# Altium project TIMER_COUNTER_MAIN.PrjPcb
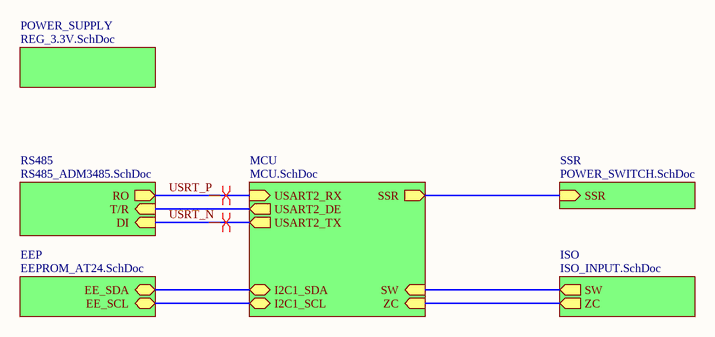
[diagram p0: MAIN.SchDoc]
7 sheets, 64 parts. Net scope: hierarchical (ports join the sheet entries above them; power ports are global).
Board file: TIMER_COUNTER_MAIN.PcbDoc
Sheets:
  MAIN.SchDoc
    EEP = EEPROM_AT24.SchDoc
    ISO = ISO_INPUT.SchDoc
    MCU = MCU.SchDoc
    SSR = POWER_SWITCH.SchDoc
    POWER_SUPPLY = REG_3.3V.SchDoc
    RS485 = RS485_ADM3485.SchDoc

## Sheet MAIN.SchDoc
size 381 x 241 mm; SheetNumber: 1; SheetTotal: 7

### Sub-sheets
EEP = EEPROM_AT24.SchDoc: EE_SCL (bidir), EE_SDA (bidir)
ISO = ISO_INPUT.SchDoc: SW (out), ZC (out)
MCU = MCU.SchDoc: SSR (out), ZC (in), SW (in), USART2_DE (out), USART2_RX (in), USART2_TX (out), I2C1_SCL (bidir), I2C1_SDA (bidir)
POWER_SUPPLY = REG_3.3V.SchDoc: no entries
RS485 = RS485_ADM3485.SchDoc: RO (out), T/R (in), DI (in)
SSR = POWER_SWITCH.SchDoc: SSR (in)

### Nets
USRT_N: sheet MCU/USART2_TX, sheet RS485/DI
USRT_P: sheet MCU/USART2_RX, sheet RS485/RO
NetC8_2: sheet EEP/EE_SCL, sheet MCU/I2C1_SCL
NetC9_2: sheet EEP/EE_SDA, sheet MCU/I2C1_SDA
NetR3_1: sheet ISO/SW, sheet MCU/SW
NetR5_1: sheet ISO/ZC, sheet MCU/ZC
NetR12_2: sheet MCU/SSR, sheet SSR/SSR
NetR20_1: sheet MCU/USART2_DE, sheet RS485/T/R

### Layout directives
differential pair: USRT_N, USRT_P

## Sheet EEPROM_AT24.SchDoc
size A; SheetNumber: 6; SheetTotal: 7
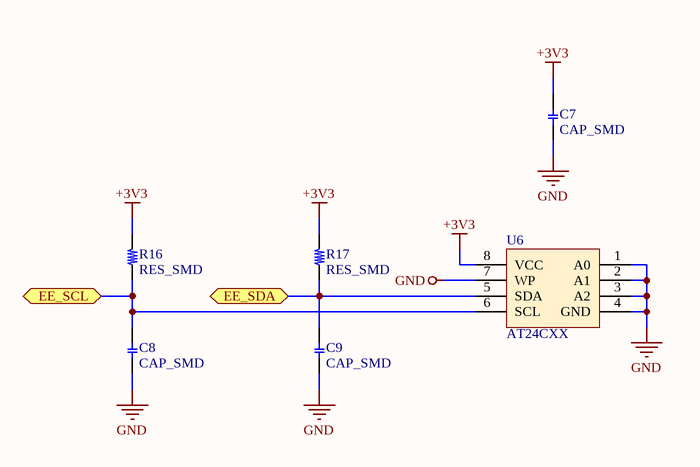
[diagram p1: EEPROM_AT24.SchDoc]

### Parts
C7  CAP_SMD  [C 0603]
C8  CAP_SMD  [C 0603]
C9  CAP_SMD  [C 0603]
R16  RES_SMD  [R 0603]
R17  RES_SMD  [R 0603]
U6  AT24CXX  [SOIC-8]

### Ports
EE_SCL (bidir), EE_SDA (bidir)

### Nets
+3V3: C7.2 R16.2 R17.2 U6.8(VCC)
GND: C7.1 C8.1 C9.1 U6.1(A0) U6.2(A1) U6.3(A2) U6.4(GND) U6.7(WP)
NetC8_2: C8.2 R16.1 U6.6(SCL) ; port EE_SCL
NetC9_2: C9.2 R17.1 U6.5(SDA) ; port EE_SDA

## Sheet ISO_INPUT.SchDoc
size 381 x 241 mm; SheetNumber: 2; SheetTotal: 7
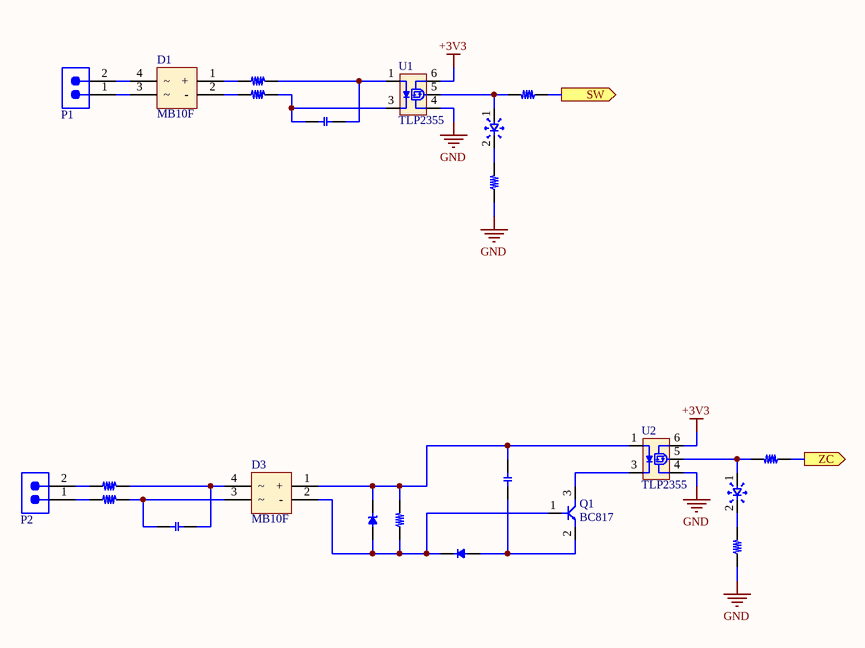
[diagram p2: ISO_INPUT.SchDoc]

### Parts
C1  CAP_SMD  [C 1206]  (value not drawn)
C2  CAP_SMD  [C 1206]  (value not drawn)
C3  CAP_SMD  [C 1206]  (value not drawn)
D1  MB10F  [MBF]
D2  LED_SMD  [D 0603]  (value not drawn)
D3  MB10F  [MBF]
D4  LED_SMD  [D 0603]  (value not drawn)
D5  DIOD_SMD_ZENER  [DIOD_SMA]  (value not drawn)
D6  DIOD_SMD  [DIOD_SMA]  (value not drawn)
P1  691321300002  [691321300002]  (value not drawn)
P2  691321300002  [691321300002]  (value not drawn)
Q1  BC817  [SOT-23_3_Q]
R1  RES_SMD  [R 1206]  (value not drawn)
R2  RES_SMD  [R 1206]  (value not drawn)
R3  RES_SMD  [R 0603]  (value not drawn)
R4  RES_SMD  [R 0603]  (value not drawn)
R5  RES_SMD  [R 0603]  (value not drawn)
R6  RES_SMD  [R 1206]  (value not drawn)
R7  RES_SMD  [R 1206]  (value not drawn)
R8  RES_SMD  [R 1206]  (value not drawn)
R9  RES_SMD  [R 0603]  (value not drawn)
U1  TLP2355  [SOIC-6-5]
U2  TLP2355  [SOIC-6-5]

### Ports
SW (out), ZC (out)

### Nets
+3V3: U1.6(VCC) U2.6(VCC)
GND: R4.1 R9.1 U1.4(GND) U2.4(GND)
NetC1_1: C1.1 R2.2 U1.3(K)
NetC1_2: C1.2 R1.2 U1.1(A)
NetC2_1: C2.1 D3.1(+) D5.2 R8.2 U2.1(A)
NetC2_2: C2.2 D6.1 Q1.2(E)
NetC3_1: C3.1 D3.3 R7.2
NetC3_2: C3.2 D3.4 R6.2
NetD1_1: D1.1(+) R1.1
NetD1_2: D1.2(-) R2.1
NetD1_3: D1.3 P1.1
NetD1_4: D1.4 P1.2
NetD2_1: D2.1 R3.2 U1.5(OUT)
NetD2_2: D2.2 R4.2
NetD3_2: D3.2(-) D5.1 D6.2 Q1.1(B) R8.1
NetD4_1: D4.1 R5.2 U2.5(OUT)
NetD4_2: D4.2 R9.2
NetP2_1: P2.1 R7.1
NetP2_2: P2.2 R6.1
NetQ1_3: Q1.3(C) U2.3(K)
NetR3_1: R3.1 ; port SW
NetR5_1: R5.1 ; port ZC

### Library data of the parts
P1 P2 = 691321300002: WR-TBL Series 321 Vertical PCB Header, Through Hole, pitch 3.81mm, 2p; Manufacturer: Wurth Elektronik; Pin Number: 2; Rated Current: 10A; Working Voltage: 300V; Modularity: No; ComponentLink1Description: Manufacturer Link; ComponentLink1URL: https://www.we-online.com/redexpert/article/691321300002?ad; ComponentLink2Description: Datasheet; ComponentLink2URL: https://www.we-online.com/redexpert/spec/691321300002?ad; Category: Terminal Blocks; Match Code: WR-TBL; Manufacturer Part Number: 691321300002; Mount: Through Hole; Operating Temperature Max: 105°C; Operating Temperature Min: -40°C; Packaging: Box; Pitch: 3.81mm; Orientation: Vertical; Application: Pluggable; PCB/Cable/Panel: PCB

## Sheet MCU.SchDoc
size 381 x 241 mm; SheetNumber: 5; SheetTotal: 7
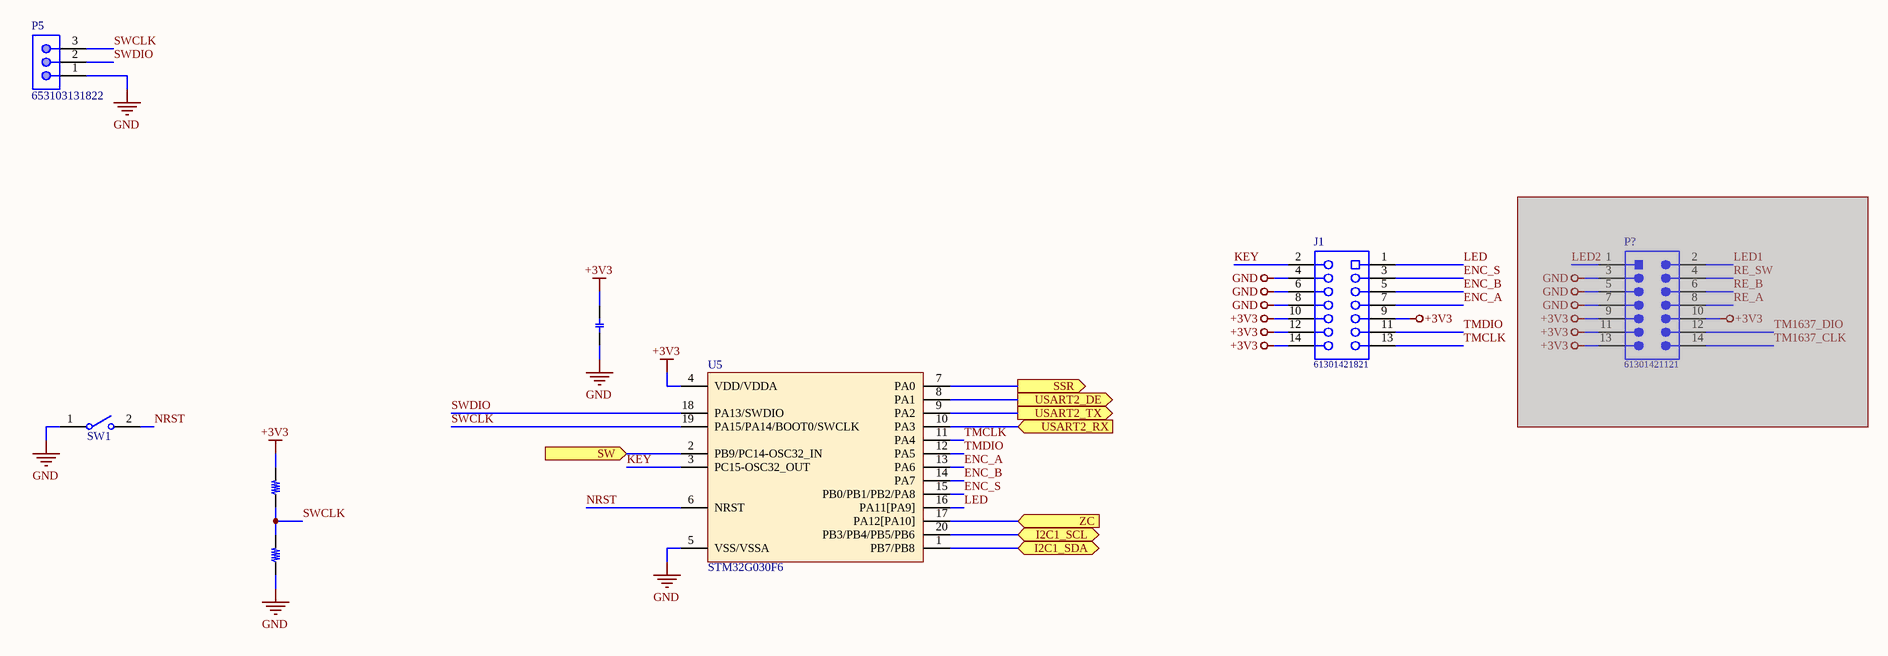
[diagram p3: MCU.SchDoc]

### Parts
C6  CAP_SMD  [C 0603]  (value not drawn)
J1  61301421821  [61301421821]
P5  653103131822  [653103131822]
P?  61301421121  [61301421121]  (masked out: inside a compile mask, not in the netlist)
R14  RES_SMD  [R 0603]  (value not drawn)
R15  RES_SMD  [R 0603]  (value not drawn)
SW1  430133050816  [WS-TASV_L6W6H5_4301330508x6]  (value not drawn)
U5  STM32G030F6  [TSSOP-20]

### Ports
I2C1_SCL (bidir), I2C1_SDA (bidir), SSR (out), SW (in), USART2_DE (out), USART2_RX (in), USART2_TX (out), ZC (in)

### Nets
+3V3: C6.2 J1.9 J1.10 J1.12 J1.14 R14.2 U5.4(VDD/VDDA)
GND: C6.1 J1.4 J1.6 J1.8 P5.1 R15.1 SW1.1 U5.5(VSS/VSSA)
ENC_A: J1.7 U5.13(PA6)
ENC_B: J1.5 U5.14(PA7)
ENC_S: J1.3 U5.15(PB0/PB1/PB2/PA8)
KEY: J1.2 U5.3(PC15-OSC32_OUT)
LED: J1.1 U5.16(PA11[PA9])
NRST: SW1.2 U5.6(NRST)
SWCLK: P5.3 R14.1 R15.2 U5.19(PA15/PA14/BOOT0/SWCLK)
SWDIO: P5.2 U5.18(PA13/SWDIO)
TMCLK: J1.13 U5.11(PA4)
TMDIO: J1.11 U5.12(PA5)
USRT_N: U5.9(PA2) ; port USART2_TX
USRT_P: U5.10(PA3) ; port USART2_RX
NetC8_2: U5.20(PB3/PB4/PB5/PB6) ; port I2C1_SCL
NetC9_2: U5.1(PB7/PB8) ; port I2C1_SDA
NetR3_1: U5.2(PB9/PC14-OSC32_IN) ; port SW
NetR5_1: U5.17(PA12[PA10]) ; port ZC
NetR12_2: U5.7(PA0) ; port SSR
NetR20_1: U5.8(PA1) ; port USART2_DE

### Library data of the parts
J1 = 61301421821: WR-PHD Socket Header, THT, pitch 2.54mm, Dual Row, Vertical, 14p; Manufacturer: Wurth Elektronik; Pin Number: 14; Rated Current: 3A; Working Voltage: 250VAC; Withstanding Voltage: 500VAC; Contact Resistance: 20mOhm; ComponentLink1Description: Manufacturer; ComponentLink1URL: http://www.we-online.de; ComponentLink2Description: Datasheet; ComponentLink2URL: https://www.we-online.com/catalog/datasheet/61301421821.pdf; Manufacturer Part Number: 61301421821; Pitch: 2.54mm; Operating Temperature: -40 to +125degC; Mounting Technology: THT; Packaging: Tray; Gender: Socket Header; Row Number: Dual; Orientation: Vertical
P5 = 653103131822: WR-WTB SMT Male Horizontal Shrouded Header, pitch 1.25mm, 3p; Pin Number: 3; Contact Resistance: 20mOhm; Rated Current: 1A; Withstanding Voltage: 250VAC; Working Voltage: 125VAC; ComponentLink1Description: Manufacturer; ComponentLink1URL: http://www.we-online.de; ComponentLink2Description: Datasheet; ComponentLink2URL: https://www.we-online.com/catalog/datasheet/653103131822.pdf; Pitch: 1.25mm; Published Date: January 2020; Publisher: Wurth Elektronik; Mounting Technology: SMT; Packaging: Tape and Reel; Operating Temperature: -40 to +85degC; Part Number: 653103131822; Gender: Male; Type: Horizontal
P? = 61301421121: WR-PHD Pin Header, THT, pitch 2.54mm, Dual Row, Vertical, 14p; Manufacturer: Wurth Elektronik; Pin Number: 14; Rated Current: 3A; Working Voltage: 250VAC; Withstanding Voltage: 500VAC; Contact Resistance: 20mOhm; ComponentLink1Description: Manufacturer; ComponentLink1URL: http://www.we-online.de; ComponentLink2Description: Datasheet; ComponentLink2URL: https://www.we-online.com/catalog/datasheet/61301421121.pdf; Manufacturer Part Number: 61301421121; Pitch: 2.54mm; Operating Temperature: -40 to +105degC; Mounting Technology: THT; Packaging: Bag; Gender: Pin Header; Row Number: Dual; Orientation: Vertical
SW1 = 430133050816: WS-TASV SMT long travel tact switch, L6 x W6 x H5mm, 160g, SPST-NO, 16V, 50mA; Manufacturer: Wurth Elektronik; Washable: No; Manufacturer Part Number: 430133050816; Category: Tact Switches; Match Code: WS-TASV; ComponentLink1Description: Website Link; ComponentLink1URL: https://www.we-online.com/redexpert/article/430133050816?ad; ComponentLink2Description: Datasheet Link; ComponentLink2URL: https://www.we-online.com/redexpert/spec/430133050816?ad; Mount: Surface Mount; Operating Temperature Max: 125°C; Operating Temperature Min: -40°C; Packaging: Tape and Reel; Length: 6mm; Width: 6mm; Height: 5mm; Circuit: SPST-NO; Contact Material: Stainless Steel; Contact Plating: Silver; Operation Force: 160g; Rated Current: 50mA; Rated Voltage (DC): 16V; Terminal Material: Copper Alloy; Terminal Plating: Silver

## Sheet POWER_SWITCH.SchDoc
size A; SheetNumber: 4; SheetTotal: 7
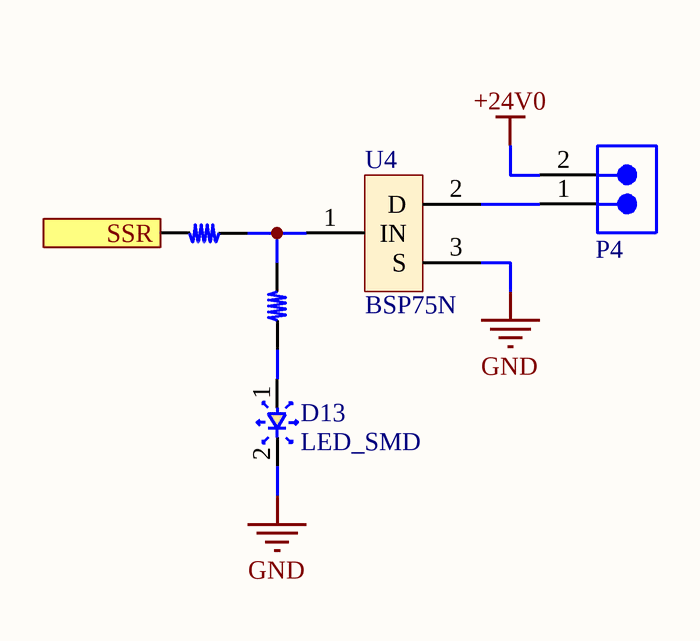
[diagram p4: POWER_SWITCH.SchDoc]

### Parts
D13  LED_SMD  [D 0603]
P4  691321300002  [691321300002]  (value not drawn)
R12  RES_SMD  [R 0603]  (value not drawn)
R13  RES_SMD  [R 0603]  (value not drawn)
U4  BSP75N  [SOT-223 - BSP75N]

### Ports
SSR (in)

### Nets
+24V0: P4.2
GND: D13.2 U4.3(S)
NetD13_1: D13.1 R13.1
NetP4_1: P4.1 U4.2(D)
NetR12_1: R12.1 R13.2 U4.1(IN)
NetR12_2: R12.2 ; port SSR

### Library data of the parts
P4 = 691321300002: as P1 on sheet ISO_INPUT; ComponentLink1Description: Manufacturer Link; ComponentLink1URL: https://www.we-online.com/redexpert/article/691321300002?ad; ComponentLink2Description: Datasheet; ComponentLink2URL: https://www.we-online.com/redexpert/spec/691321300002?ad; Category: Terminal Blocks; Match Code: WR-TBL; Manufacturer Part Number: 691321300002; Mount: Through Hole; Operating Temperature Max: 105°C; Operating Temperature Min: -40°C; Packaging: Box; Pitch: 3.81mm; Orientation: Vertical; Application: Pluggable; PCB/Cable/Panel: PCB

## Sheet REG_3.3V.SchDoc
size A; SheetNumber: 3; SheetTotal: 7
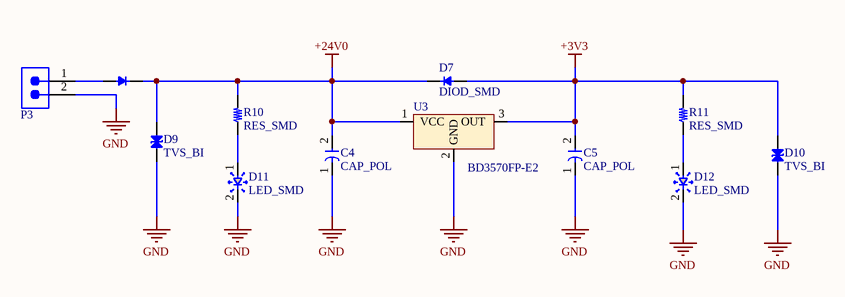
[diagram p5: REG_3.3V.SchDoc]

### Parts
C4  CAP_POL  [CAP_SMC]
C5  CAP_POL  [CAP_SMA]
D7  DIOD_SMD  [DIOD_SMA]
D8  DIOD_SMD  [DIOD_SMA]  (value not drawn)
D9  TVS_BI  [DIOD_SMB]
D10  TVS_BI  [DIOD_SMB]
D11  LED_SMD  [D 0603]
D12  LED_SMD  [D 0603]
P3  691321300002  [691321300002]  (value not drawn)
R10  RES_SMD  [R 0603]
R11  RES_SMD  [R 0603]
U3  BD3570FP-E2  [DPAK-U]

### Nets
+3V3: C5.2 D7.1 D10.2 R11.2 U3.3(OUT)
+24V0: C4.2 D7.2 D8.2 D9.2 R10.2 U3.1(VCC)
GND: C4.1 C5.1 D9.1 D10.1 D11.2 D12.2 P3.2 U3.2(GND)
NetD8_1: D8.1 P3.1
NetD11_1: D11.1 R10.1
NetD12_1: D12.1 R11.1

### Library data of the parts
D9 D10 = DIOD_SMD_TVS_BI
P3 = 691321300002: as P1 on sheet ISO_INPUT; ComponentLink1Description: Manufacturer Link; ComponentLink1URL: https://www.we-online.com/redexpert/article/691321300002?ad; ComponentLink2Description: Datasheet; ComponentLink2URL: https://www.we-online.com/redexpert/spec/691321300002?ad; Category: Terminal Blocks; Match Code: WR-TBL; Manufacturer Part Number: 691321300002; Mount: Through Hole; Operating Temperature Max: 105°C; Operating Temperature Min: -40°C; Packaging: Box; Pitch: 3.81mm; Orientation: Vertical; Application: Pluggable; PCB/Cable/Panel: PCB

## Sheet RS485_ADM3485.SchDoc
size 381 x 241 mm; SheetNumber: 7; SheetTotal: 7
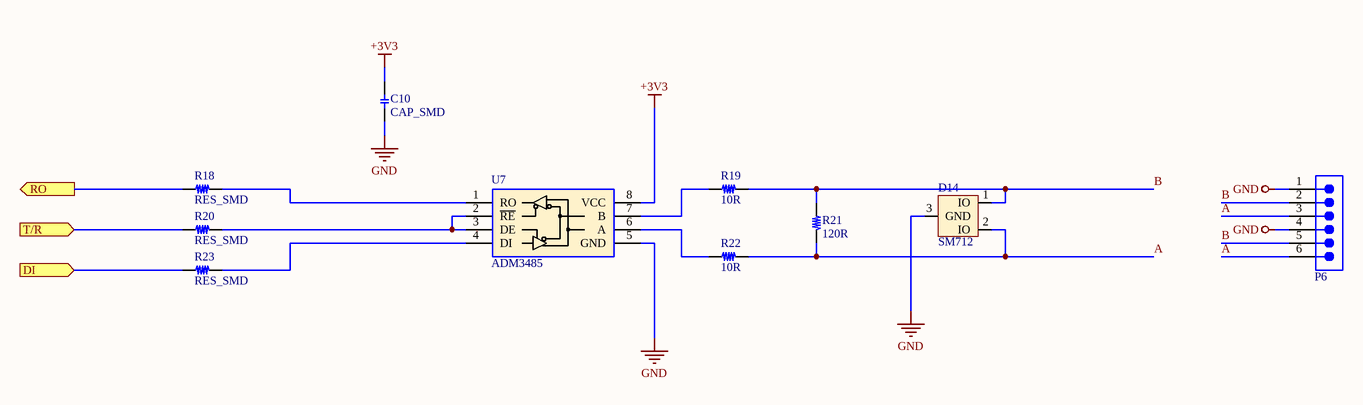
[diagram p6: RS485_ADM3485.SchDoc]

### Parts
C10  CAP_SMD  [C 0603]
D14  SM712  [SOT-23_3_D]
P6  691321300006  [691321300006]  (value not drawn)
R18  RES_SMD  [R 0603]
R19  10R  [R 1206]
R20  RES_SMD  [R 0603]
R21  120R  [R 1206]
R22  10R  [R 1206]
R23  RES_SMD  [R 0603]
U7  ADM3485  [SOIC-8]

### Ports
DI (in), RO (out), T/R (in)

### Nets
+3V3: C10.2 U7.8(VCC)
GND: C10.1 D14.3(GND) P6.1 P6.4 U7.5(GND)
A: D14.2(IO) P6.3 P6.6 R21.2 R22.2
B: D14.1(IO) P6.2 P6.5 R19.2 R21.1
USRT_N: R23.1 ; port DI
USRT_P: R18.1 ; port RO
NetR18_2: R18.2 U7.1(RO)
NetR19_1: R19.1 U7.7(B)
NetR20_1: R20.1 ; port T/R
NetR20_2: R20.2 U7.2(~{RE}) U7.3(DE)
NetR22_1: R22.1 U7.6(A)
NetR23_2: R23.2 U7.4(DI)

### Library data of the parts
P6 = 691321300006: WR-TBL Series 321 Vertical PCB Header, Through Hole, pitch 3.81mm, 6p; Manufacturer: Wurth Elektronik; Pin Number: 6; Rated Current: 10A; Working Voltage: 300V; Modularity: No; ComponentLink1Description: Manufacturer Link; ComponentLink1URL: https://www.we-online.com/redexpert/article/691321300006?ad; ComponentLink2Description: Datasheet; ComponentLink2URL: https://www.we-online.com/redexpert/spec/691321300006?ad; Category: Terminal Blocks; Match Code: WR-TBL; Manufacturer Part Number: 691321300006; Mount: Through Hole; Operating Temperature Max: 105°C; Operating Temperature Min: -40°C; Packaging: Box; Pitch: 3.81mm; Orientation: Vertical; Application: Pluggable; PCB/Cable/Panel: PCB
R19 R21 R22 = RES_SMD

## Nets that join several sheets
+3V3: EEPROM_AT24 (C7.2 R16.2 R17.2 U6.8), ISO_INPUT (U1.6 U2.6), MCU (7 pins), REG_3.3V (5 pins), RS485_ADM3485 (C10.2 U7.8)
+24V0: POWER_SWITCH (P4.2), REG_3.3V (6 pins)
GND: EEPROM_AT24 (8 pins), ISO_INPUT (R4.1 R9.1 U1.4 U2.4), MCU (8 pins), POWER_SWITCH (D13.2 U4.3), REG_3.3V (8 pins), RS485_ADM3485 (5 pins)
NetC8_2: EEPROM_AT24 (C8.2 R16.1 U6.6), MCU (U5.20)
NetC9_2: EEPROM_AT24 (C9.2 R17.1 U6.5), MCU (U5.1)
NetR3_1: ISO_INPUT (R3.1), MCU (U5.2)
NetR5_1: ISO_INPUT (R5.1), MCU (U5.17)
NetR12_2: MCU (U5.7), POWER_SWITCH (R12.2)
NetR20_1: MCU (U5.8), RS485_ADM3485 (R20.1)
USRT_N: MCU (U5.9), RS485_ADM3485 (R23.1)
USRT_P: MCU (U5.10), RS485_ADM3485 (R18.1)